# EAGLE design usb_module (EAGLE 5.07)
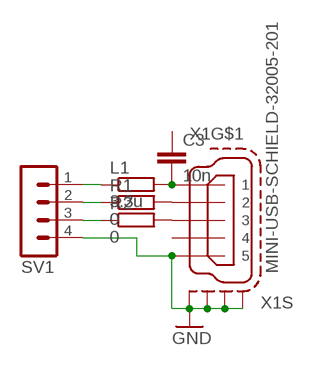
[diagram p0: schematic, sheet 1]

## Parts
C3  10n  C-EUC0805  [C0805]
L1  3.3u  R-EU_M1206  [M1206]
R1  0  R-EU_M1206  [M1206]
R2  0  R-EU_M1206  [M1206]
SV1  MA04-1  [MA04-1]
X1  MINI-USB-SCHIELD-32005-201  [32005-201]

## Nets
GND: SV1.4 X1.5 X1.M1(S:S1) X1.M2(S:S2) X1.M3(S:S3) X1.M4(S:S4)
N$1: C3.2 L1.2 X1.1
N$2: R1.1 SV1.2
N$3: R2.1 SV1.3
N$5: R1.2 X1.2
N$6: R2.2 X1.3
N$7: L1.1 SV1.1
Unconnected: C3.1 X1.4

## Library data of the parts
C3 = rcl:C-EU: CAPACITOR, European symbol
L1 R1 R2 = rcl:R-EU_: RESISTOR, European symbol
SV1 = con-lstb:MA04-1: PIN HEADER
X1 = con-cypressindustries:MINI-USB-SCHIELD-: MINI USB-B Conector Source: www.cypressindustries.com

## Board
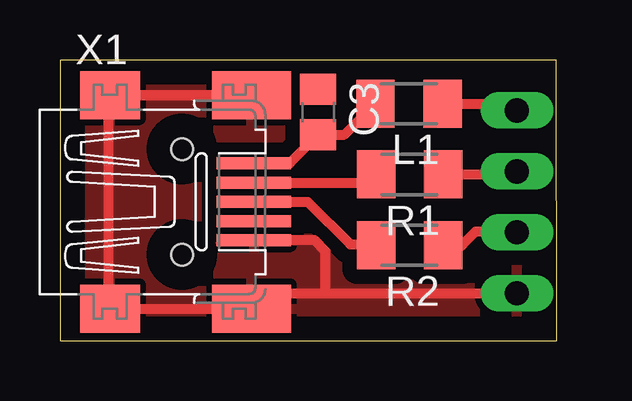
[diagram p1: board, top side]
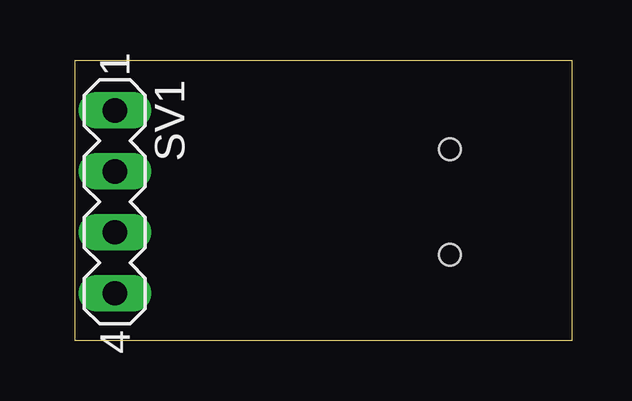
[diagram p2: board, bottom side, seen from below]

Size 20.71 x 11.7 mm. Coordinates in mm from the lower left corner, seen from the top.
Outline: 0,0 20.71,0 20.71,11.7 0,11.7 0,0
Copper layers (1*16): Top 0.035mm / dielectric 1.5mm / Bottom 0.035mm
Design rules "default": minimum track width 10mil, minimum drill 24mil, track to track 8mil, track to pad 8mil, pad to pad 8mil, via to via 8mil, smd to smd 8mil, copper to edge 40mil, drill to drill 8mil, minimum pad ring 10mil, minimum via ring 8mil, stop-mask expansion 4mil, vias tented up to drill 0mil, thermal gap 10mil

### Footprints (pad centres in the part's own frame; a part is rotated, then mirrored left to right if it is on the bottom)
C0805 = smd 1.3 x 1.5: 1 -0.95,0; 2 0.95,0
M1206 = smd 1.6 x 2: 1 -1.4,0; 2 1.4,0
MA04-1 = drill 1.016 long: 1 -3.81,0; 2 -1.27,0; 3 1.27,0; 4 3.81,0
32005-201 = smd 3.1 x 0.5: 1 3,1.6; 2 3,0.8; 3 3,0; 4 3,-0.8; 5 3,-1.6 | smd 2.5 x 2: M1 -3,-4.45; M2 -3,4.45 | smd 3.3 x 2: M3 2.9,4.45; M4 2.9,-4.45 | hole 0.9: 0,2.2; 0,-2.2

### Placement (x,y rotation side)
C3  10.77,9.54 270 top
L1  14.56,9.89 180 top
R1  14.58,6.93 180 top
R2  14.58,3.98 180 top
SV1  19.05,5.79 270 bottom
X1  5.08,5.79 0 top

### Tracks (layer width: path | path; a pad name or v marks a point on that pad's centre or on a via)
GND
  Top 0.406: 11.15,1.98 8.72,1.98 8.44,1.7 8.34,1.7 X1.M4 X1.M1 2.02,1.41 2.02,10.27 2.05,10.24 X1.M3 X1.M2 | 11.15,1.98 SV1.4 | X1.5 10.6,4.19 11.08,3.72 11.08,2.05 11.15,1.98
  pour Top (isolate 0.61): 0.2,11.77 -0.06,11.77 -0.06,0.07 20.93,0.07 20.93,11.9
N$1
  Top 0.406: X1.1 9.57,7.39 C3.2 11.86,8.59 L1.2
N$2
  Top 0.406: R1.1 18.92,6.93 SV1.2
N$3
  Top 0.406: R2.1 16.76,3.98 17.34,4.56 19.02,4.56 SV1.3
N$5
  Top 0.406: X1.2 12.84,6.59 R1.2
N$6
  Top 0.406: X1.3 10.33,5.79 12.11,4.02 13.15,4.02 R2.2
N$7
  Top 0.406: L1.1 18.77,9.89 SV1.1